# Altium schematic sheet MainBoardNew.SchDoc
size A4
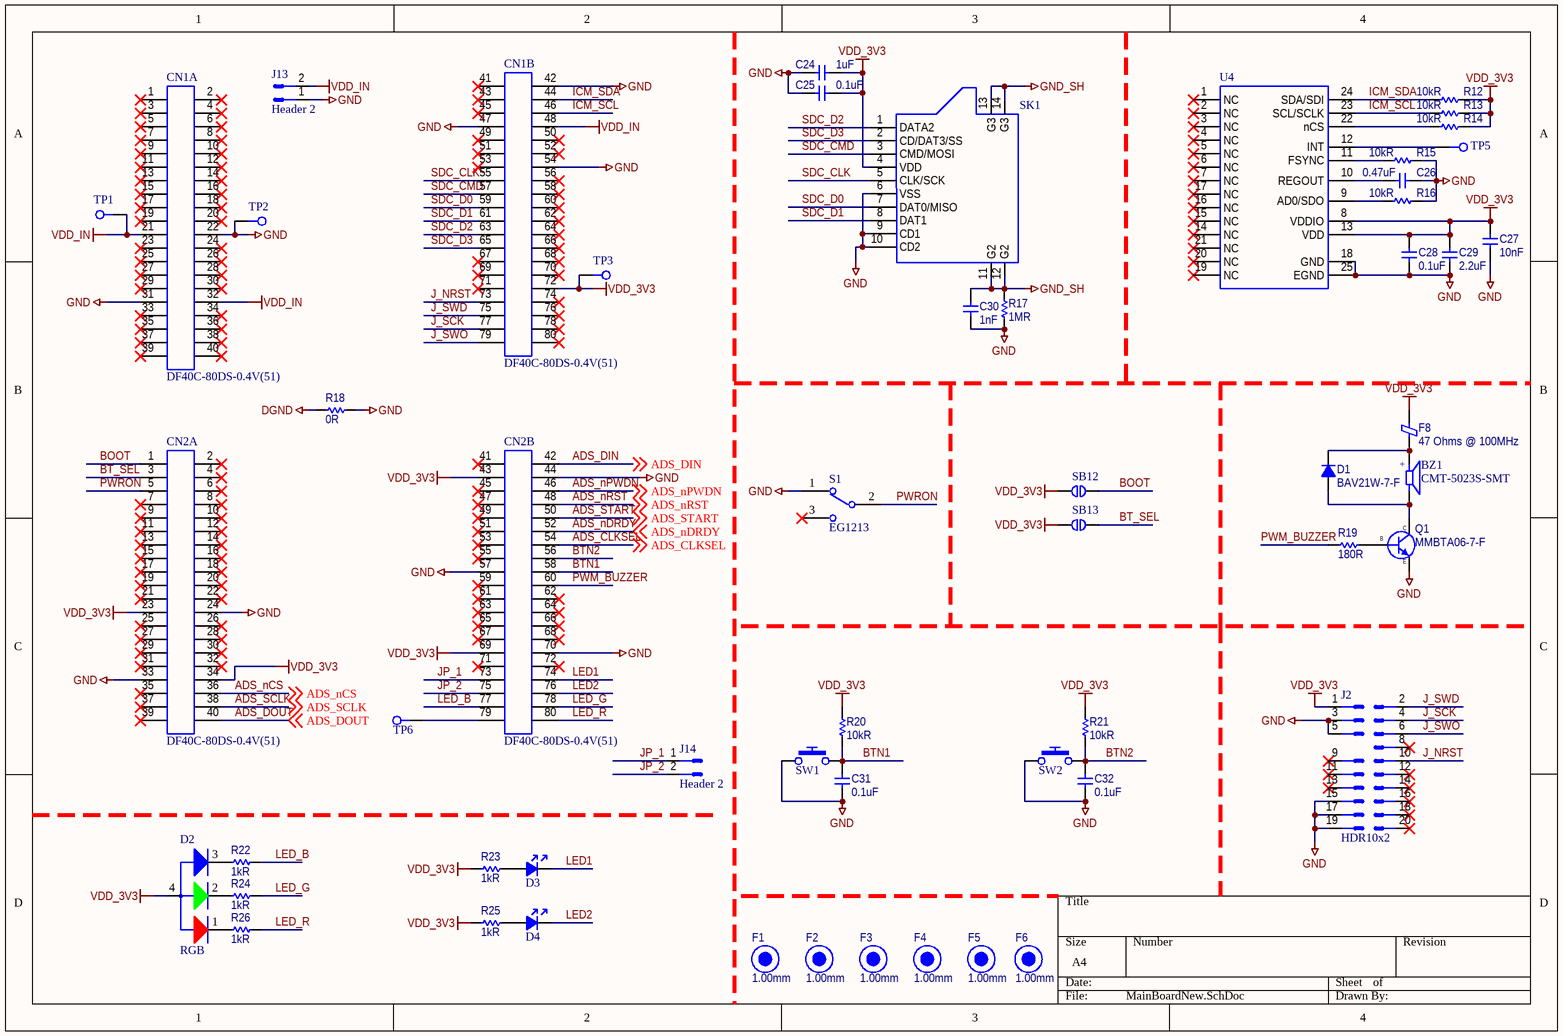
[diagram p0: MainBoardNew.SchDoc]

## Parts
BZ1  CMT-5023S-SMT  [CUI_CMT-5023S-SMT]
C24  1uF  [C1005X04N]
C25  0.1uF  [C1005X04N]
C26  0.47uF  [C1005X04N]
C27  10nF  [C1005X04N]
C28  0.1uF  [C1005X04N]
C29  2.2uF  [C1005X04N]
C30  1nF  [C1005X04N]
C31  0.1uF  [C1005X04N]
C32  0.1uF  [C1005X04N]
CN1  DF40C-80DS-0.4V(51)  [DF40C-80DS-0.4V(51)]  (parts A,B of 2)
CN2  DF40C-80DS-0.4V(51)  [DF40C-80DS-0.4V(51)]  (parts A,B of 2)
D1  BAV21W-7-F  [SOD123]
D2  RGB  [LED 3528 PLCC4 RGB]
D3  LED BLUE  [LED0603]  (value not drawn)
D4  LED BLUE  [LED0603]  (value not drawn)
F1  1.00mm  [FIDUCIAL10-30]
F2  1.00mm  [FIDUCIAL10-30]
F3  1.00mm  [FIDUCIAL10-30]
F4  1.00mm  [FIDUCIAL10-30]
F5  1.00mm  [FIDUCIAL10-30]
F6  1.00mm  [FIDUCIAL10-30]
F8  47 Ohms @ 100MHz  [F2012X06N]
J2  HDR10x2  [FTSH-110-01-L-DV-007-P-TR]
J13  Header 2  [HDR1x2]
J14  Header 2  [HDR1x2]
Q1  MMBTA06-7-F  [SOT95P245X110-3N]
R12  10kR  [R1005X04N]
R13  10kR  [R1005X04N]
R14  10kR  [R1005X04N]
R15  10kR  [R1005X04N]
R16  10kR  [R1005X04N]
R17  1MR  [R1005X04N]
R18  0R  [R1005X04N]
R19  180R  [R1005X04N]
R20  10kR  [R1005X04N]
R21  10kR  [R1005X04N]
R22  1kR  [R1005X04N]
R23  1kR  [R1005X04N]
R24  1kR  [R1005X04N]
R25  1kR  [R1005X04N]
R26  1kR  [R1005X04N]
S1  EG1213  [SW_EG1213]
SB12  Solder Jump  [SJB_0603]  (value not drawn)
SB13  Solder Jump  [SJB_0603]  (value not drawn)
SK1  MICRO SD CARD  [114-00841-68]  (value not drawn)
SW1  FSMRA4JH04  [1-1825027-1]  (value not drawn)
SW2  FSMRA4JH04  [1-1825027-1]  (value not drawn)
TP1  TP_25MILC  [TESTPOINT_1MM]  (value not drawn)  (no BOM)
TP2  TP_25MILC  [TESTPOINT_1MM]  (value not drawn)  (no BOM)
TP3  TP_25MILC  [TESTPOINT_1MM]  (value not drawn)  (no BOM)
TP5  TP_25MILC  [TESTPOINT_1MM]  (value not drawn)  (no BOM)
TP6  TP_25MILC  [TESTPOINT_1MM]  (value not drawn)  (no BOM)
U4  ICM-20689  [QFN50P400X400X100_HS-25N-NP]  (value not drawn)

## Nets
DGND: R18.1
GND: C24.1 C25.2 C26.2 C27.1 C28.2 C29.1 C30.1 C31.1 C32.1 CN1.22 CN1.31 CN1.42 CN1.47 CN1.54 CN2.24 CN2.33 CN2.44 CN2.57 CN2.70 J2.3 J2.5 J2.15 J2.17 J2.19 J13.1 Q1.2(E) R15.1 R16.1 R17.1 R18.2 S1.1 SK1.6(VSS) SK1.9(CD1) SK1.10(CD2) SW1.1 SW2.1 TP2.1 U4.18(GND) U4.25(EGND)
GND_SH: C30.2 R17.2 SK1.11(G2) SK1.12(G2) SK1.13(G3) SK1.14(G3)
VDD_3V3: C24.2 C25.1 C27.2 C28.1 C29.2 CN1.72 CN2.23 CN2.34 CN2.43 CN2.69 D2.4(COMM_ANODE) F8.2 J2.1 R12.1 R13.1 R14.1 R20.2 R21.2 R23.1 R25.1 SB12.2 SB13.2 SK1.4(VDD) TP3.1 U4.8(VDDIO) U4.13(VDD)
VDD_IN: CN1.21 CN1.32 CN1.48 J13.2 TP1.1
ADS_CLKSEL: CN2.54 ; off-sheet ADS_CLKSEL
ADS_DIN: CN2.42 ; off-sheet ADS_DIN
ADS_DOUT: CN2.40 ; off-sheet ADS_DOUT
ADS_nCS: CN2.36 ; off-sheet ADS_nCS
ADS_nDRDY: CN2.52 ; off-sheet ADS_nDRDY
ADS_nPWDN: CN2.46 ; off-sheet ADS_nPWDN
ADS_nRST: CN2.48 ; off-sheet ADS_nRST
ADS_SCLK: CN2.38 ; off-sheet ADS_SCLK
ADS_START: CN2.50 ; off-sheet ADS_START
BOOT: CN2.1 SB12.1
BT_SEL: CN2.3 SB13.1
BTN1: C31.2 CN2.58 R20.1 SW1.2
BTN2: C32.2 CN2.56 R21.1 SW2.2
ICM_SCL: CN1.46 R13.2 U4.23(SCL/SCLK)
ICM_SDA: CN1.44 R12.2 U4.24(SDA/SDI)
J_NRST: CN1.73 J2.10
J_SCK: CN1.77 J2.4
J_SWD: CN1.75 J2.2
J_SWO: CN1.79 J2.6
JP_1: CN2.73 J14.1
JP_2: CN2.75 J14.2
LED1: CN2.74 D3.2(K)
LED2: CN2.76 D4.2(K)
LED_B: CN2.77 R22.2
LED_G: CN2.78 R24.2
LED_R: CN2.80 R26.2
PWM_BUZZER: CN2.60 R19.1
PWRON: CN2.5 S1.2
SDC_CLK: CN1.55 SK1.5(CLK/SCK)
SDC_CMD: CN1.57 SK1.3(CMD/MOSI)
SDC_D0: CN1.59 SK1.7(DAT0/MISO)
SDC_D1: CN1.61 SK1.8(DAT1)
SDC_D2: CN1.63 SK1.1(DATA2)
SDC_D3: CN1.65 SK1.2(CD/DAT3/SS)
NetBZ1_N: BZ1.N D1.2(A) Q1.3(C)
NetBZ1_P: BZ1.P D1.1(C) F8.1
NetC26_1: C26.1 U4.10(REGOUT)
NetCN2_79: CN2.79 TP6.1
NetD2_1: D2.1(CATHODE_RED) R26.1
NetD2_2: D2.2(CATHODE_GREEN) R24.1
NetD2_3: D2.3(CATHODE_BLUE) R22.1
NetD3_1: D3.1(A) R23.2
NetD4_1: D4.1(A) R25.2
NetQ1_1: Q1.1(B) R19.2
NetR14_2: R14.2 U4.22(nCS)
NetR15_2: R15.2 U4.11(FSYNC)
NetR16_2: R16.2 U4.9(AD0/SDO)
NetTP5_1: TP5.1 U4.12(INT)

Not connected (* = marked no-connect by the designer): CN1 1* 2* 3* 4* 5* 6* 7* 8* 9* 10* 11* 12* 13* 14* 15* 16* 17* 18* 19* 20* 23* 24* 25* 26* 27* 28* 29* 30* 33* 34* 35* 36* 37* 38* 39* 40* 41* 43* 45* 49* 50* 51* 52* 53* 56* 58* 60* 62* 64* 66* 67* 68* 69* 70* 71* 74* 76* 78* 80*; CN2 2* 4* 6* 7* 8* 9* 10* 11* 12* 13* 14* 15* 16* 17* 18* 19* 20* 21* 22* 25* 26* 27* 28* 29* 30* 31* 32* 35* 37* 39* 41* 45* 47* 49* 51* 53* 55* 59* 61* 62* 63* 64* 65* 66* 67* 68* 71* 72*; J2 8* 9* 11* 12* 13* 14* 16* 18* 20*; S1 3*; U4 1(NC)* 2(NC)* 3(NC)* 4(NC)* 5(NC)* 6(NC)* 7(NC)* 14(NC)* 15(NC)* 16(NC)* 17(NC)* 19(NC)* 20(NC)* 21(NC)*

## Notes on the sheet
- (in symbol CMT-5023S-SMT) +

## Library data of the parts
BZ1 = CMT-5023S-SMT: AUDIO MAGNETIC XDCR 2-4V SMD; Manufacturer: CUI Devices; Manufacturer Part Number: CMT-5023S-SMT-TR
C24 = EMK105BJ105KV-F: CAP CER,1UF,10%,16V,X5R,0402,SMD; Manufacturer: Taiyo Yuden; No: 96; Capacitor Type: Ceramic Capacitor; Manufacturer Part Number: EMK105BJ105KV-F; VNPT Part Number: EMK105BJ105KV-F; Capacitance: 1uF; Voltage - Rated: 16V; Tolerance: 10%; Mounting Type: Surface Mount (SMD); Package: 0402; Temperature Coefficient: X5R
C25 C28 C31 C32 = TMK105BJ104MV-F: CAP CER,0.1UF,20%,25V,X5R,0402,SMD; Manufacturer: Taiyo Yuden; No: 79; Capacitor Type: Ceramic Capacitor; Manufacturer Part Number: TMK105BJ104MV-F; VNPT Part Number: TMK105BJ104MV-F; Capacitance: 0.1uF; Voltage - Rated: 25V; Tolerance: 20%; Mounting Type: Surface Mount (SMD); Package: 0402; Temperature Coefficient: X5R
C26 = TMK105ABJ474KVHF: CAP CER,0.47UF,10%,25V,X5R,0402,SMD; Manufacturer: Taiyo Yuden; No: 122; Capacitor Type: Ceramic Capacitor; Manufacturer Part Number: TMK105ABJ474KVHF; VNPT Part Number: TMK105ABJ474KVHF; Capacitance: 0.47uF; Voltage - Rated: 25V; Tolerance: 10%; Mounting Type: Surface Mount (SMD); Package: 0402; Temperature Coefficient: X5R
C27 = UMK105B7103KV-F: CAP CER,10NF,10%,50V,X7R,0402,SMD; Manufacturer: Taiyo Yuden; No: 33; Capacitor Type: Ceramic Capacitor; Manufacturer Part Number: UMK105B7103KV-F; VNPT Part Number: UMK105B7103KV-F; Capacitance: 10nF; Voltage - Rated: 50V; Tolerance: 10%; Mounting Type: Surface Mount (SMD); Package: 0402; Temperature Coefficient: X7R
C29 = TMK105CBJ225MV-F: CAP CER,2.2UF,20%,25V,X5R,0402,SMD; Manufacturer: Taiyo Yuden; No: 140; Capacitor Type: Ceramic Capacitor; Manufacturer Part Number: TMK105CBJ225MV-F; VNPT Part Number: TMK105CBJ225MV-F; Capacitance: 2.2uF; Voltage - Rated: 25V; Tolerance: 20%; Mounting Type: Surface Mount (SMD); Package: 0402; Temperature Coefficient: X5R
C30 = UMK105B7102KV-F: CAP CER,1NF,10%,50V,X7R,0402,SMD; Manufacturer: Taiyo Yuden; No: 120; Capacitor Type: Ceramic Capacitor; Manufacturer Part Number: UMK105B7102KV-F; VNPT Part Number: UMK105B7102KV-F; Capacitance: 1nF; Voltage - Rated: 50V; Tolerance: 10%; Mounting Type: Surface Mount (SMD); Package: 0402; Temperature Coefficient: X7R
CN1 CN2 = DF40C-80DS-0.4V(51): CONN RCPT 80POS SMD GOLD; Manufacturer: Hirose Electric Co Ltd; Manufacturer Part Number: DF40C-80DS-0.4V(51)
D1 = BAV21W-7-F: DIODE,200V,200MA,1-CH,ID,SOD-123,SMD; Manufacturer: Diodes Incorporated; No: 22; Diode Type: Standard Diode; Number of Channel: 1; Manufacturer Part Number: BAV21W-7-F; VNPT Part Number: BAV21W-7-F; Voltage - DC Reverse (Vr): 200V; Current - Average Rectified (If): 200mA; Mounting Type: Surface Mount (SMD); Package: SOD-123
D2 = BL-HJXGXBX32M-A: 3528 PLCC4 RGB; Manufacturer: American Bright Optoelectronics Corporation; Manufacturer Part Number: BL-HJXGXBX32M-A
D3 D4 = LTST-C191TBKT: LED BLUE CLEAR CHIP SMD
F1-F6 = FIDUCIAL10-30: FIDUCIAL,1.00mm,3.00mm; Manufacturer: VNPT-Technology; No: 5; Manufacturer Part Number: FIDUCIAL10-30; VNPT Part Number: FIDUCIAL10-30; Mounted Pad: 1.00mm; Solder Mask: 3.00mm; Keepout Diameter: 3.00mm; Assembly Top: 1.00mm
F8 = BK2125HS470-T: FERRITE BEAD,47 OHMS @ 100MHZ,0.05R,1A,0805,SMD; Manufacturer: Taiyo Yuden; No: 4; Manufacturer Part Number: BK2125HS470-T; VNPT Part Number: BK2125HS470-T; Impedance: 47 Ohms @ 100MHz; DC Resistance (DCR): 0.05R; Current Rating: 1A; Mounting Type: Surface Mount (SMD); Package: 0805
J2 = FTSH-110-01-L-DV-007-P-TR: CONN HEADER SMD 20POS 1.27MM; Parameter 1: *; Parameter 2: *; Parameter 3: *
Q1 = MMBTA06-7-F: BJT NPN,80V,500MA,SOT23-3,SMD; Manufacturer: Diodes Incorporated; No: 9; Manufacturer Part Number: MMBTA06-7-F; VNPT Part Number: MMBTA06-7-F; BJT Type: NPN; Vce (Max): 80V; Ic (Max): 500mA; Mounting Type: Surface Mount (SMD); Package: SOT23-3 (SOT23, TO236AB, SOT346, SC59A, TO236AA, SMT3)
R12-R16 R20 R21 = RC0402FR-0710KL: RES,10KR,1%,62.5MW,0402,SMD; Manufacturer: Yageo; No: 35; Manufacturer Part Number: RC0402FR-0710KL; VNPT Part Number: RC0402FR-0710KL; Resistance: 10kR; Tolerance: 1%; Power: 62.5mW; Resistor Type: Genneral Purpose Resistor; Mounting Type: Surface Mount (SMD); Package: 0402
R17 = RC0402FR-071ML: RES,1MR,1%,62.5MW,0402,SMD; Manufacturer: Yageo; No: 52; Manufacturer Part Number: RC0402FR-071ML; VNPT Part Number: RC0402FR-071ML; Resistance: 1MR; Tolerance: 1%; Power: 62.5mW; Resistor Type: Genneral Purpose Resistor; Mounting Type: Surface Mount (SMD); Package: 0402
R18 = RC0402FR-070RL: RES,0R,JUMPER,62.5MW,0402,SMD; Manufacturer: Yageo; No: 7; Manufacturer Part Number: RC0402FR-070RL; VNPT Part Number: RC0402FR-070RL; Resistance: 0R; Tolerance: JUMPER; Power: 62.5mW; Resistor Type: Genneral Purpose Resistor; Mounting Type: Surface Mount (SMD); Package: 0402
R19 = CRCW0402180RFKEDHP: RES,180R,1%,200MW,0402,SMD; Manufacturer: Vishay / Dale; No: 137; Manufacturer Part Number: CRCW0402180RFKEDHP; VNPT Part Number: CRCW0402180RFKEDHP; Resistance: 180R; Tolerance: 1%; Power: 200mW; Resistor Type: Genneral Purpose Resistor; Mounting Type: Surface Mount (SMD); Package: 0402
R22-R26 = RC0402JR-071KL: RES,1KR,5%,62.5MW,0402,SMD; Manufacturer: Yageo; No: 63; Manufacturer Part Number: RC0402JR-071KL; VNPT Part Number: RC0402JR-071KL; Resistance: 1kR; Tolerance: 5%; Power: 62.5mW; Resistor Type: Genneral Purpose Resistor; Mounting Type: Surface Mount (SMD); Package: 0402
S1 = EG1213: SWITCH SLIDE SPDT 200MA 30V; Manufacturer: E-Switch; Manufacturer Part Number: EG1213
SB12 SB13 = Solder Jump: Solder Bridge Jumper 0603
SK1 = 114-00841-68: CONN MICRO SD CARD PUSH-PULL R/A; Manufacturer: Amphenol ICC (Commercial Products); Manufacturer Part Number: 114-00841-68
SW1 SW2 = FSMRA4JH04: SWITCH TACTILE SPST-NO 0.05A 24V; Manufacturer: TE Connectivity; Manufacturer Part Number: FSMRA4JH04
TP1-TP3 TP5 TP6 = TP_25MILC: Test Point 25mil
U4 = ICM-20689: IMU ACCEL/GYRO/MAG I2C/SPI 24QFN; Manufacturer: TDK InvenSense; Manufacturer Part Number: ICM-20689